# EAGLE schematic LCD (EAGLE 9.4.2)
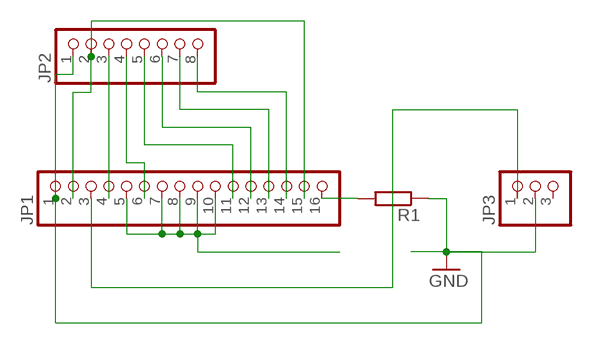
[diagram p0: schematic, sheet 1]

## Parts
JP1  PINHD-1X16  [1X16]
JP2  PINHD-1X8  [1X08]
JP3  PINHD-1X3  [1X03]
R1  R-EU_0207/12  [0207/12]

## Nets
GND: JP1.1 JP2.1 JP3.2 R1.1
N$1: JP1.16 R1.2
N$2: JP1.2 JP1.15 JP2.2
N$3: JP1.3 JP3.1
N$5: JP1.4 JP2.3
N$6: JP1.6 JP2.4
N$7: JP1.5 JP1.7 JP1.8 JP1.9 JP1.10
N$8: JP1.14 JP2.8
N$9: JP1.13 JP2.7
N$10: JP1.12 JP2.6
N$11: JP1.11 JP2.5
Unconnected: JP3.3

## Library data of the parts
JP1 = pinhead:PINHD-1X16: PIN HEADER
JP2 = pinhead:PINHD-1X8: PIN HEADER
JP3 = pinhead:PINHD-1X3: PIN HEADER
R1 = rcl:R-EU_: RESISTOR, European symbol; SPICEPREFIX: R